# Altium schematic sheet Radio.SchDoc
size A4
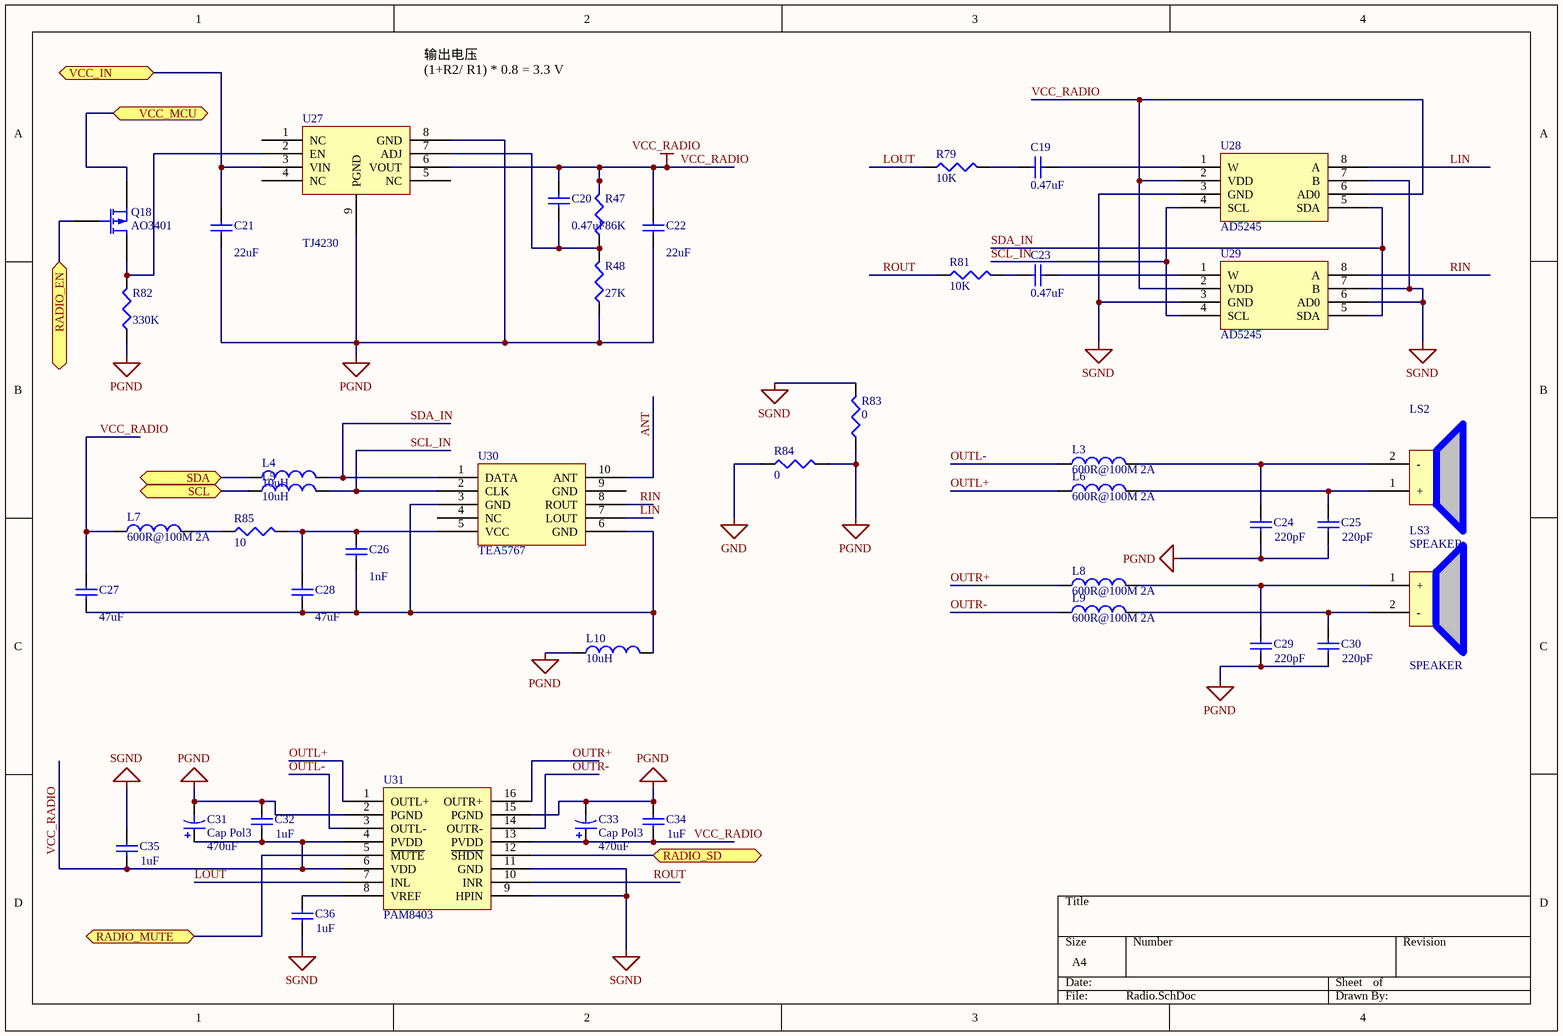
[diagram p0: Radio.SchDoc]

## Parts
C19  value 0.47uF  [0603]  (hidden comment: Cap Semi)
C20  value 0.47uF  [0603]  (hidden comment: Cap Semi)
C21  value 22uF  [1206]  (hidden comment: Cap Semi)
C22  value 22uF  [1206]  (hidden comment: Cap Semi)
C23  value 0.47uF  [0603]  (hidden comment: Cap Semi)
C24  value 220pF  [0603]  (hidden comment: Cap Semi)
C25  value 220pF  [0603]  (hidden comment: Cap Semi)
C26  value 1nF  [0603]  (hidden comment: Cap Semi)
C27  value 47uF  [1210]  (hidden comment: Cap Semi)
C28  value 47uF  [1210]  (hidden comment: Cap Semi)
C29  value 220pF  [0603]  (hidden comment: Cap Semi)
C30  value 220pF  [0603]  (hidden comment: Cap Semi)
C31  Cap Pol3  value 470uF  [TC7343-2917]
C32  value 1uF  [0603]  (hidden comment: Cap Semi)
C33  Cap Pol3  value 470uF  [TC7343-2917]
C34  value 1uF  [0603]  (hidden comment: Cap Semi)
C35  value 1uF  [0603]  (hidden comment: Cap Semi)
C36  value 1uF  [0603]  (hidden comment: Cap Semi)
L3  value 600R@100M 2A  [0805]  (hidden comment: Inductor)
L4  value 10uH  [0603]  (hidden comment: Inductor)
L5  value 10uH  [0603]  (hidden comment: Inductor)
L6  value 600R@100M 2A  [0805]  (hidden comment: Inductor)
L7  value 600R@100M 2A  [0805]  (hidden comment: Inductor)
L8  value 600R@100M 2A  [0805]  (hidden comment: Inductor)
L9  value 600R@100M 2A  [0805]  (hidden comment: Inductor)
L10  value 10uH  [0603]  (hidden comment: Inductor)
LS2  SPEAKER  [SPEAKER]
LS3  SPEAKER  [SPEAKER]
Q18  AO3401  [SOT23-3-PMOS]
R47  value 86K  [0603]  (hidden comment: Res3)
R48  value 27K  [0603]  (hidden comment: Res3)
R79  value 10K  [0603]  (hidden comment: Res3)
R81  value 10K  [0603]  (hidden comment: Res3)
R82  value 330K  [0603]  (hidden comment: Res3)
R83  value 0  [0603]  (hidden comment: Res3)
R84  value 0  [0603]  (hidden comment: Res3)
R85  value 10  [0603]  (hidden comment: Res3)
U27  TJ4230  [SOP8-PAD]
U28  AD5245  [SOT23-8]
U29  AD5245  [SOT23-8]
U30  TEA5767  [TEA5767]
U31  PAM8403  [SOP16]

## Ports
RADIO_EN (bidir), RADIO_MUTE (bidir), RADIO_SD (bidir), SCL (bidir), SDA (bidir), VCC_IN (bidir), VCC_MCU (bidir)

## Nets
GND: R84.1
PGND: C21.1 C22.1 C24.1 C25.1 C29.1 C30.1 C31.2 C32.2 C33.2 C34.2 L10.1 R48.1 R82.1 R83.1 R84.2 U27.8(GND) U27.9(PGND) U31.2(PGND) U31.15(PGND)
SGND: C35.2 C36.1 R83.2 U28.3(GND) U28.7(B) U29.3(GND) U29.6(AD0) U29.7(B) U31.9(HPIN) U31.11(GND)
VCC_RADIO: C20.2 C22.2 C27.2 C31.1 C32.1 C33.1 C34.1 C35.1 L7.1 R47.2 U27.6(VOUT) U28.2(VDD) U28.6(AD0) U29.2(VDD) U31.4(PVDD) U31.6(VDD) U31.13(PVDD)
ANT: U30.10(ANT)
LIN: U28.8(A) U30.7(LOUT)
LOUT: R79.1 U31.7(INL)
OUTL+: L6.1 U31.1(OUTL+)
OUTL-: L3.1 U31.3(OUTL-)
OUTR+: L8.1 U31.16(OUTR+)
OUTR-: L9.1 U31.14(OUTR-)
RADIO_EN: Q18.2(G) ; port RADIO_EN
RADIO_MUTE: U31.5(~{MUTE}) ; port RADIO_MUTE
RADIO_SD: U31.12(~{SHDN}) ; port RADIO_SD
RIN: U29.8(A) U30.8(ROUT)
ROUT: R81.1 U31.10(INR)
SCL: L5.1 ; port SCL
SCL_IN: L5.2 U28.4(SCL) U29.4(SCL) U30.2(CLK)
SDA: L4.1 ; port SDA
SDA_IN: L4.2 U28.5(SDA) U29.5(SDA) U30.1(DATA)
VCC_IN: C21.2 U27.3(VIN) ; port VCC_IN
VCC_MCU: Q18.3(S) ; port VCC_MCU
NetC19_1: C19.1 R79.2
NetC19_2: C19.2 U28.1(W)
NetC20_1: C20.1 R47.1 R48.2 U27.7(ADJ)
NetC23_1: C23.1 R81.2
NetC23_2: C23.2 U29.1(W)
NetC24_2: C24.2 L3.2 LS2.2(-)
NetC25_2: C25.2 L6.2 LS2.1(+)
NetC26_1: C26.1 C27.1 C28.1 L10.2 U30.3(GND) U30.6(GND)
NetC26_2: C26.2 C28.2 R85.2 U30.5(VCC)
NetC29_2: C29.2 L8.2 LS3.1(+)
NetC30_2: C30.2 L9.2 LS3.2(-)
NetC36_2: C36.2 U31.8(VREF)
NetL7_2: L7.2 R85.1
NetQ18_1: Q18.1(D) R82.2 U27.2(EN)

Not connected (* = marked no-connect by the designer): U27 1(NC) 4(NC) 5(NC); U30 4(NC) 9(GND)

## Notes on the sheet
- 输出电压
  (1+R2/ R1) * 0.8 = 3.3 V

## Library data of the parts
C19-C30 C32 C34-C36 = Cap Semi: Capacitor (Semiconductor SIM Model); Published: 8-Jun-2000; LatestRevisionDate: 29-May-2009; LatestRevisionNote: IPC-7351 Footprint Added.; PackageReference: C1206; Publisher: Altium Limited; PackageDescription: Chip Capacitor
C31 C33 = Cap Pol3: Polarized Capacitor (Surface Mount); Published: 8-Jun-2000; LatestRevisionDate: 29-May-2009; LatestRevisionNote: IPC-7351 Footprint Added.; PackageReference: C0805; Publisher: Altium Limited; PackageDescription: Chip Capacitor
L3-L10 = Inductor: Code_IEC: 1005; Published: 8-Jun-2000; LatestRevisionDate: 29-May-2009; LatestRevisionNote: IPC-7351 Footprint Added.; PackageReference: 0402-A; Publisher: Altium Limited; PackageDescription: Chip Inductor; Code_JEITA: 0402
Q18 = MOSFET-P: P-Channel MOSFET; Published: 8-Jun-2000; LatestRevisionDate: 17-Jul-2002; LatestRevisionNote: Re-released for DXP Platform.; PackageVersion: 1995/1996; PackageReference: E3; Publisher: Altium Limited; PackageDescription: TO, Flat Index; 3 In-Line, Axial Leads; Body Dia. 4.6mm; Lead Dia. 0.5 mm (max)
R47 R48 R79 R81-R85 = Res3: Resistor; Published: 8-Jun-2000; LatestRevisionDate: 29-May-2009; LatestRevisionNote: IPC-7351 Footprint Added.; PackageReference: J1-0603; Publisher: Altium Limited; PackageDescription: Chip Resistor